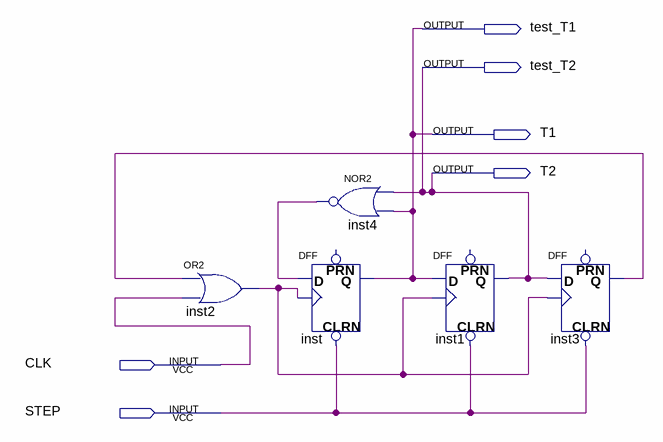
[diagram p0: schematic sheet]
// Quartus schematic clkstep.bdf as structural Verilog: 5 symbols, 6 pins
module clkstep (
  input  CLK,
  input  STEP,
  output test_T1,
  output test_T2,
  output T1,
  output T2
);

  wire inst2_out, inst3_q, inst4_out;

  or inst2 (inst2_out, inst3_q, CLK);
  nor inst4 (inst4_out, T2, T1);
  DFF inst (.CLRN(STEP), .CLK(inst2_out), .D(inst4_out), .Q(T1));  // open: PRN
  DFF inst1 (.CLRN(STEP), .CLK(inst2_out), .D(T1), .Q(T2));  // open: PRN
  DFF inst3 (.CLRN(STEP), .CLK(inst2_out), .D(T2), .Q(inst3_q));  // open: PRN

  assign test_T1 = T1;
  assign test_T2 = T2;
endmodule
